# EasyEDA Pro project joint_controller.eprj

# Schematic Schematic1
Board Name: Board1; Create Date: 2025-11-14; Page Name: P1; Project Name: joint_controller; Schematic Name: Schematic1; Update Date: 2025-11-22; Company: 嘉立创EDA; Page Size: A4; Version: V1.0
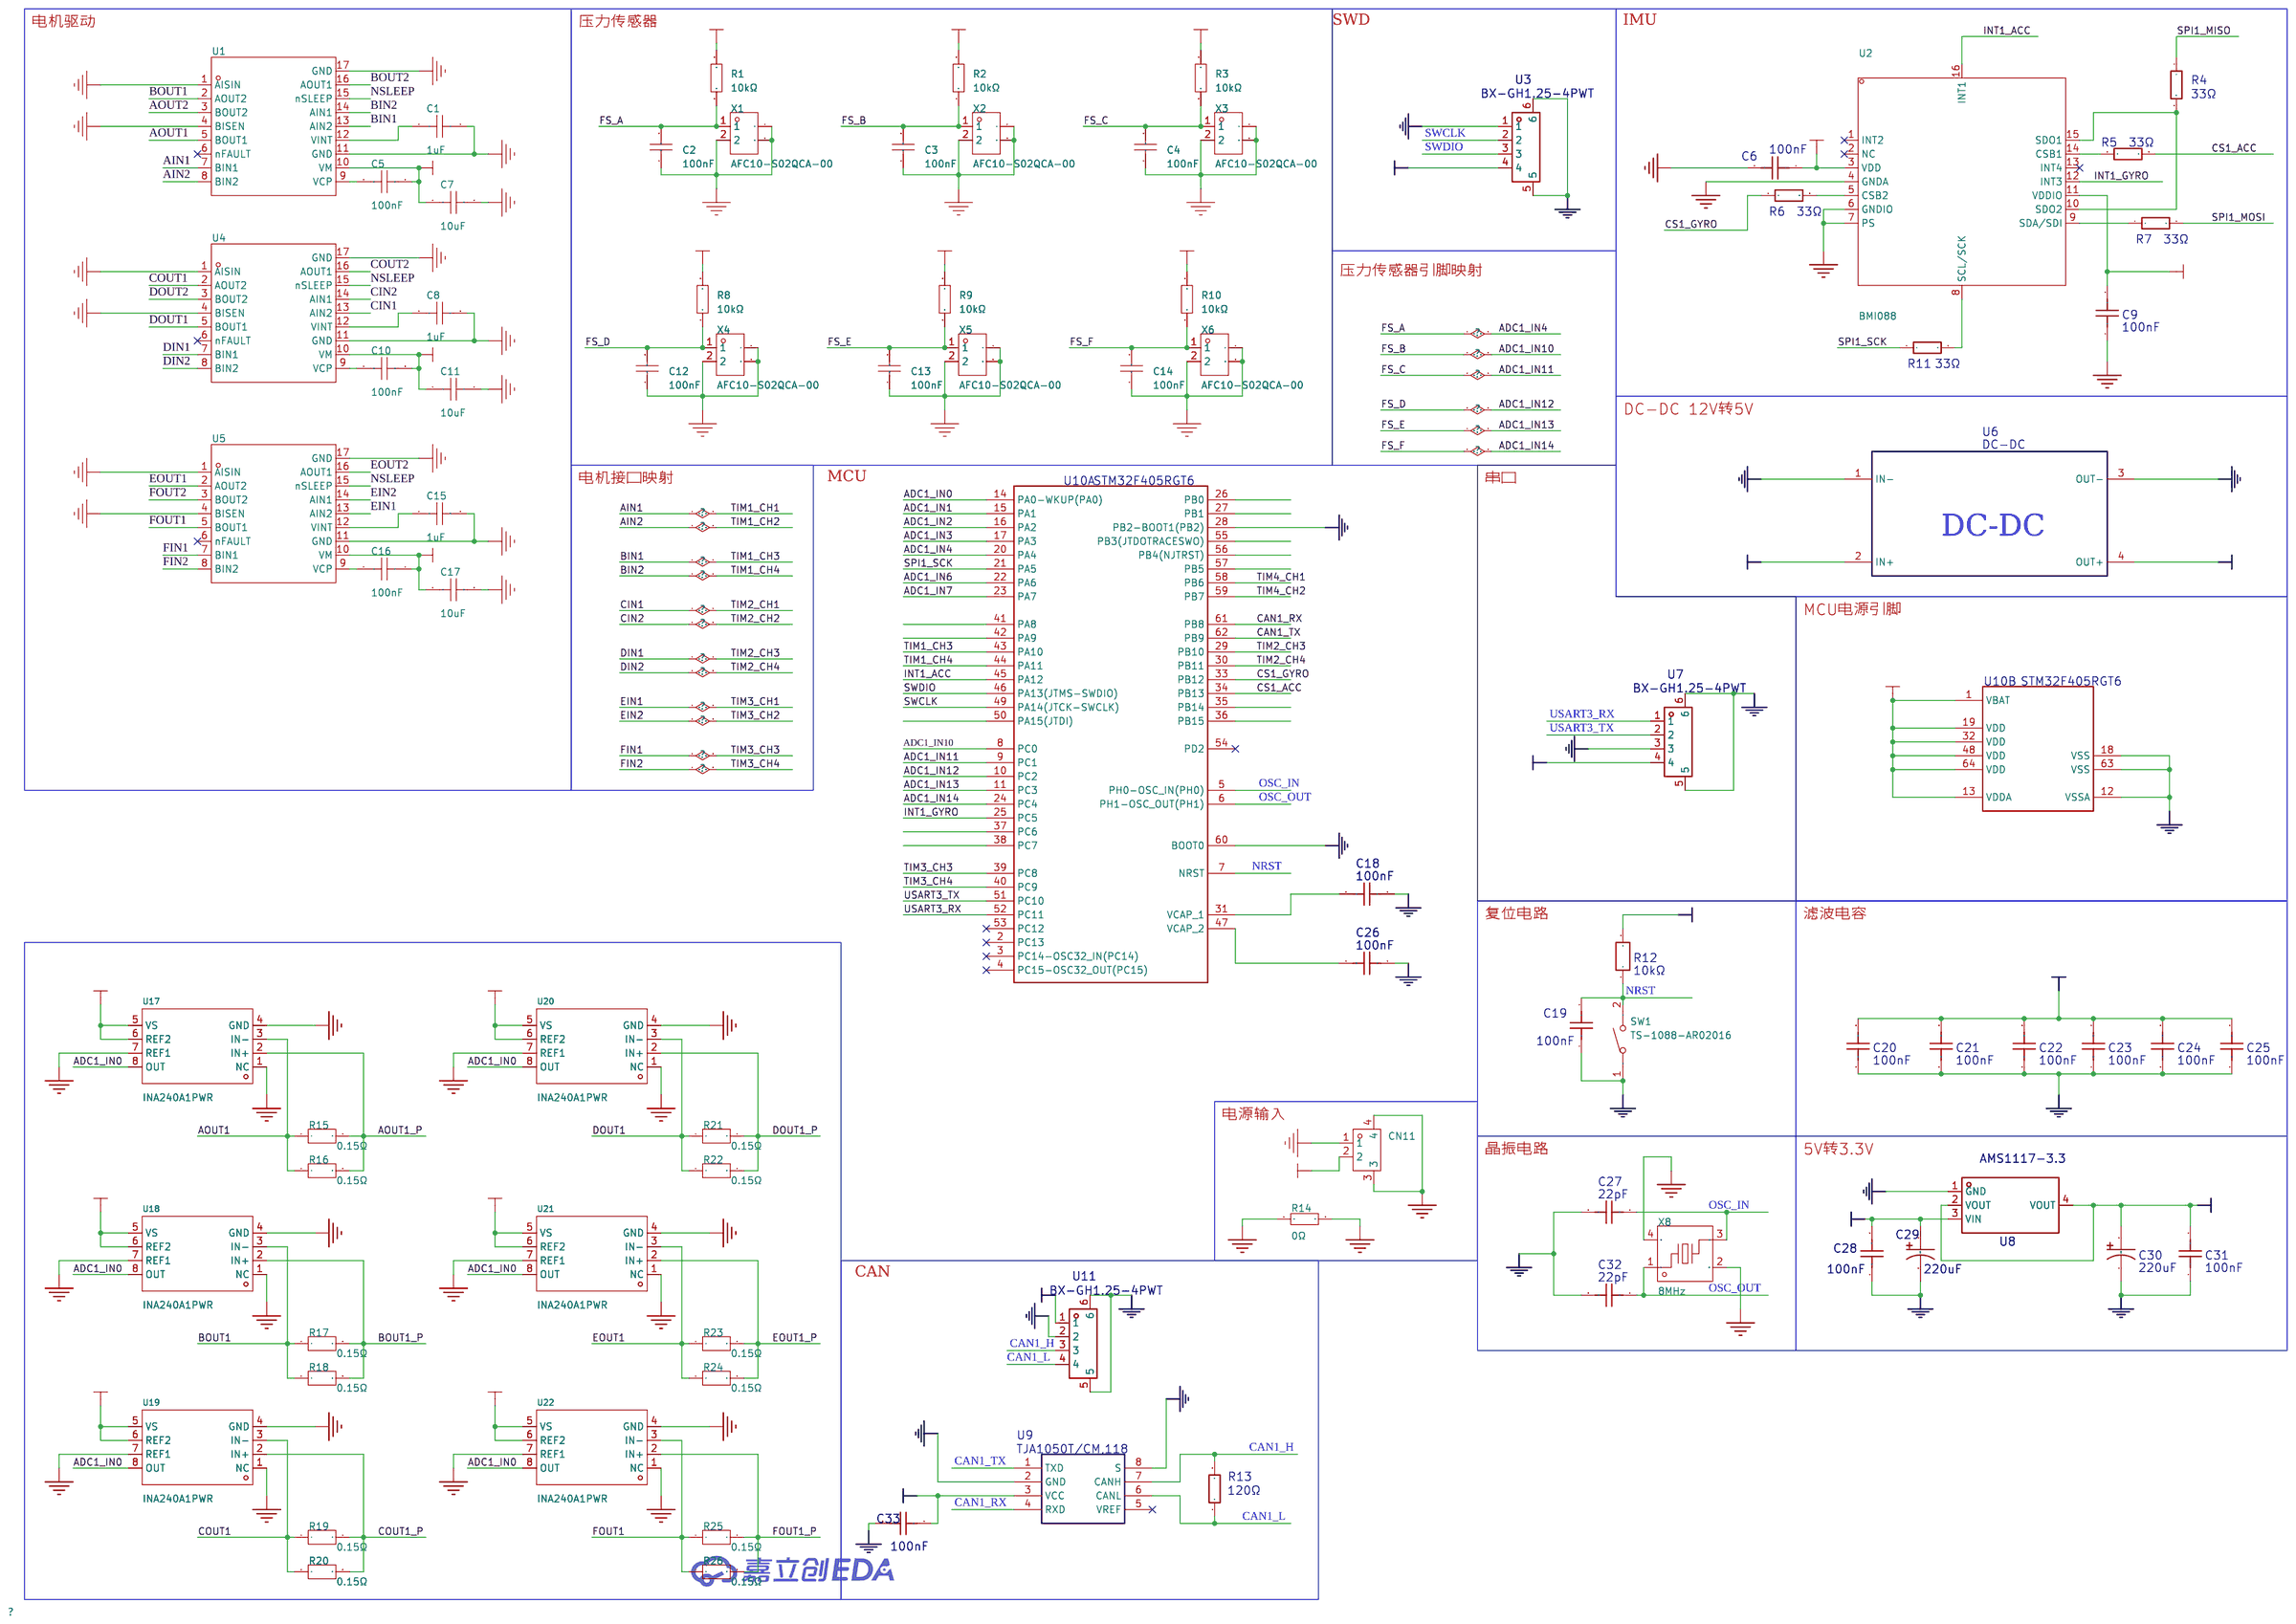
[diagram p0: schematic sheet]

## Parts
C1  1uF  [C0402]
C2  100nF  [C0402]
C3  100nF  [C0402]
C4  100nF  [C0402]
C5  100nF  [C0402]
C6  100nF  [C0603]
C7  10uF  [C0603]
C8  1uF  [C0402]
C9  100nF  [C0603]
C10  100nF  [C0402]
C11  10uF  [C0603]
C12  100nF  [C0402]
C13  100nF  [C0402]
C14  100nF  [C0402]
C15  1uF  [C0402]
C16  100nF  [C0402]
C17  10uF  [C0603]
C18  100nF  [C0603]
C19  100nF  [C0603]
C20  100nF  [C0603]
C21  100nF  [C0603]
C22  100nF  [C0603]
C23  100nF  [C0603]
C24  100nF  [C0603]
C25  100nF  [C0603]
C26  100nF  [C0603]
C27  22pF  [C0603]
C28  100nF  [C0603]
C29  220uF  [CAP-SMD_BD6.3-L6.6-W6.6-FD]
C30  220uF  [CAP-SMD_BD6.3-L6.6-W6.6-FD]
C31  100nF  [C0603]
C32  22pF  [C0603]
C33  100nF  [C0603]
CN11  M2501RS-02P  [CONN-SMD_2P-P2.50_M2501RS-02P]
R1  10kΩ  [R0402]
R2  10kΩ  [R0402]
R3  10kΩ  [R0402]
R4  33Ω  [R0805]
R5  33Ω  [R0805]
R6  33Ω  [R0805]
R7  33Ω  [R0805]
R8  10kΩ  [R0402]
R9  10kΩ  [R0402]
R10  10kΩ  [R0402]
R11  33Ω  [R0805]
R12  10kΩ  [R0603]
R13  120Ω  [R0805]
R14  0Ω  [R0603]
R15  0.15Ω  [R1812]
R16  0.15Ω  [R1812]
R17  0.15Ω  [R1812]
R18  0.15Ω  [R1812]
R19  0.15Ω  [R1812]
R20  0.15Ω  [R1812]
R21  0.15Ω  [R1812]
R22  0.15Ω  [R1812]
R23  0.15Ω  [R1812]
R24  0.15Ω  [R1812]
R25  0.15Ω  [R1812]
R26  0.15Ω  [R1812]
SW1  TS-1088-AR02016  [SW-SMD_L3.9-W3.0-P4.45]
U1  AT8833CQ  [QFN-16_L4.0-W4.0-P0.65-TL-EP2.2]
U2  BMI088  [LGA-16_L4.5-W3.0-P0.50-BL]
U3  BX-GH1.25-4PWT  [CONN-SMD_4P-P1.25_BX-GH1.25-4PWT]
U4  AT8833CQ  [QFN-16_L4.0-W4.0-P0.65-TL-EP2.2]
U5  AT8833CQ  [QFN-16_L4.0-W4.0-P0.65-TL-EP2.2]
U6  DC-DC  [DC-DC]
U7  BX-GH1.25-4PWT  [CONN-SMD_4P-P1.25_BX-GH1.25-4PWT]
U8  AMS1117-3.3  [SOT-223-3_L6.5-W3.4-P2.30-LS7.0-BR]
U9  TJA1050T/CM,118  [SOIC-8_L5.0-W4.0-P1.27-LS6.0-BL]
U10  STM32F405RGT6  [LQFP-64_L10.0-W10.0-P0.50-LS12.0-BL]  (sections 1,2)
U11  BX-GH1.25-4PWT  [CONN-SMD_4P-P1.25_BX-GH1.25-4PWT]
U17  INA240A1PWR  [TSSOP-8_L4.4-W3.0-P0.65-LS6.4-BL]
U18  INA240A1PWR  [TSSOP-8_L4.4-W3.0-P0.65-LS6.4-BL]
U19  INA240A1PWR  [TSSOP-8_L4.4-W3.0-P0.65-LS6.4-BL]
U20  INA240A1PWR  [TSSOP-8_L4.4-W3.0-P0.65-LS6.4-BL]
U21  INA240A1PWR  [TSSOP-8_L4.4-W3.0-P0.65-LS6.4-BL]
U22  INA240A1PWR  [TSSOP-8_L4.4-W3.0-P0.65-LS6.4-BL]
X1  AFC10-S02QCA-00  [CONN-SMD_AFC10-S02QCA-00]
X2  AFC10-S02QCA-00  [CONN-SMD_AFC10-S02QCA-00]
X3  AFC10-S02QCA-00  [CONN-SMD_AFC10-S02QCA-00]
X4  AFC10-S02QCA-00  [CONN-SMD_AFC10-S02QCA-00]
X5  AFC10-S02QCA-00  [CONN-SMD_AFC10-S02QCA-00]
X6  AFC10-S02QCA-00  [CONN-SMD_AFC10-S02QCA-00]
X8  8MHz  [CRYSTAL-SMD_4P-L3.2-W2.5-BL]

## Library data of the parts
C1 C8 C15 = CL05A105KA5NQNC: 容值:1uF;精度:±10%;额定电压:25V;材质(温度系数):X5R;; LCSC Part Name: 1uF ±10% 25V; Supplier Part: C52923; Manufacturer: SAMSUNG(三星); Supplier Footprint: 0402; JLCPCB Part Class: Basic Part; Datasheet: https://atta.szlcsc.com/upload/public/pdf/source/20160103/1457707735223.pdf; Supplier: LCSC; Tolerance: ±10%; Voltage Rated: 25V; Temperature Coefficient: X5R
C2-C4 C12-C14 = CL05B104KO5NNNC: 容值:100nF;精度:±10%;额定电压:16V;材质(温度系数):X7R;; LCSC Part Name: 100nF ±10% 16V; Supplier Part: C1525; Manufacturer: SAMSUNG(三星); Supplier Footprint: 0402; JLCPCB Part Class: Basic Part; Datasheet: https://atta.szlcsc.com/upload/public/pdf/source/20160103/1457707674891.pdf; Supplier: LCSC; Tolerance: ±10%; Voltage Rated: 16V; Temperature Coefficient: X7R
C5 C10 C16 = CL05B104KB54PNC: 容值:100nF;精度:±10%;额定电压:50V;材质(温度系数):X7R;; LCSC Part Name: 100nF ±10% 50V; Supplier Part: C307331; Manufacturer: SAMSUNG(三星); Supplier Footprint: 0402; JLCPCB Part Class: 基础库; Datasheet: https://atta.szlcsc.com/upload/public/pdf/source/20181009/C307331_222F7C870FD3EA5F46F538B483443886.pdf; Supplier: LCSC; Tolerance: ±10%; Voltage Rated: 50V; Temperature Coefficient: X7R
C6 C9 C18-C26 C28 C31 C33 = 100nF: Supplier: LCSC; Supplier Part: C2266794; Manufacturer: Knowles(楼氏); Manufacturer Part: 0603J0250104KXR; JLCPCB Part Class: Extended Part
C7 C11 C17 = CL10A106MA8NRNC: 容值:10uF;精度:±20%;额定电压:25V;材质(温度系数):X5R;; LCSC Part Name: 10uF ±20% 25V; Supplier Part: C96446; Manufacturer: SAMSUNG(三星); Supplier Footprint: 0603; JLCPCB Part Class: 基础库; Datasheet: https://atta.szlcsc.com/upload/public/pdf/source/20160218/1457707763339.pdf; Supplier: LCSC; Tolerance: ±20%; Voltage Rated: 25V; Temperature Coefficient: X5R
C27 C32 = 22pF: Supplier: LCSC; Supplier Part: C2266794; Manufacturer: Knowles(楼氏); Manufacturer Part: 0603J0250104KXR; JLCPCB Part Class: Extended Part
C29 C30 = 220uF: Supplier: LCSC; Supplier Part: C165593; Manufacturer: SAMYOUNG(韩国三莹); Manufacturer Part: MVK 16V220M 6.3*8 6.3TP; JLCPCB Part Class: Extended Part
CN11 = M2501RS-02P: 参考系列:-;间距:2.5mm;插针结构:1x2P;排数:1;每排PIN数:2;行距:-;公母:公型插针;安装方式:卧贴;额定电流:3A;工作温度范围:-25℃~+85℃;; LCSC Part Name: 针座 XH 间距2.5mm 2P 卧式贴片 XH; Supplier Part: C520120; Manufacturer: XFCN(兴飞); Supplier Footprint: SMD,P=2.5mm; JLCPCB Part Class: Extended Part; Datasheet: https://atta.szlcsc.com/upload/public/pdf/source/20200424/C520124_816A4C8EE39FBA6CEF0C35CBCC209D62.pdf; Supplier: LCSC; Pitch: 2.5mm; Pins Structure: 1x2P; Number of Rows: 1; Number of PINs Per Row: 2; Gender: 公型插针; Mounting Style: 卧贴; Current Rating (Max): 3A; Operating Temperature Range: -25℃~+85℃
R1-R3 R8-R10 = 0402WGF1002TCE: 电阻类型:厚膜电阻;阻值:10kΩ;精度:±1%;功率:62.5mW;温度系数:±100ppm/℃;最大工作电压:50V;工作温度范围:-55℃~+155℃;; LCSC Part Name: 10kΩ ±1% 62.5mW; Supplier Part: C25744; Manufacturer: UNI-ROYAL(厚声); Supplier Footprint: 0402; JLCPCB Part Class: Basic Part; Datasheet: https://atta.szlcsc.com/upload/public/pdf/source/20200306/C422600_1E6D84923E4A46A82E41ADD87F860B5C.pdf; Supplier: LCSC; Type: 厚膜电阻; Tolerance: ±1%; Power(Watts): 62.5mW; Temperature Coefficient: ±100ppm/℃; Overload Voltage (Max): 50V; Operating Temperature Range: -55℃~+155℃
R4-R7 R11 = 1kΩ: Supplier: LCSC; Manufacturer: YAGEO(国巨); Manufacturer Part: RC0805FR-07120RL; Supplier Part: C114245; JLCPCB Part Class: Extended Part
R12 = 10kΩ: Supplier: LCSC; Supplier Part: C20138101; Manufacturer: VISHAY(威世); Manufacturer Part: MCT0603MG1002BP500; JLCPCB Part Class: Extended Part
R13 = 120Ω: Supplier: LCSC; Manufacturer: YAGEO(国巨); Manufacturer Part: RC0805FR-07120RL; Supplier Part: C114245; JLCPCB Part Class: Extended Part
R14 = 0603WAF0000T5E: LCSC Part Name: 0Ω ±1% 100mW 厚膜电阻; Supplier Part: C21189; Manufacturer: UNI-ROYAL(厚声); Supplier Footprint: 0603; JLCPCB Part Class: 基础库; Datasheet: https://item.szlcsc.com/datasheet/0603WAF0000T5E/21903.html; Supplier: LCSC; Type: 厚膜电阻; Tolerance: ±1%; Power(Watts): 100mW; Voltage-Supply(Max): 75V; Operating Temperature: -55℃~+155℃
R15-R26 = FRC1812J101 TS: 电阻类型:厚膜电阻;阻值:100Ω;精度:±5%;功率:750mW;最大工作电压:200V;温度系数:±100ppm/℃;; LCSC Part Name: 100Ω ±5% 750mW 厚膜电阻; Supplier Part: C2933911; Manufacturer: FOJAN(富捷); Supplier Footprint: 1812; JLCPCB Part Class: 扩展库; Datasheet: https://atta.szlcsc.com/upload/public/pdf/source/20211221/925EC7D7225764EE0046F22065062C87.pdf; Supplier: LCSC; Type: 厚膜电阻; Tolerance: ±5%; Power(Watts): 750mW; Overload Voltage (Max): 200V; Temperature Coefficient: ±100ppm/℃; Operating Temperature Range: -55℃~+155℃
SW1 = TS-1088-AR02016: 电路结构:单刀单掷;按钮形状:圆形按钮;作用力:160gf;安装方式:立贴;开关长度:4mm;开关宽度:3mm;开关高度:2mm;带支架:不带;触点电流:50mA;额定电压(DC):12V;绝缘电阻:100MΩ;机械寿命:10万次;; LCSC Part Name: 4*3*2mm 立贴 轻触开关; Supplier Part: C720477; Manufacturer: XUNPU(讯普); Supplier Footprint: SMD; JLCPCB Part Class: 扩展库; Datasheet: https://atta.szlcsc.com/upload/public/pdf/source/20200810/C720475_60D09DD6C54279ADDB2DC25100F1CC11.pdf; Supplier: LCSC; Circuit: 单刀单掷; Actuator Style: 圆形按钮; Operating Force: 160gf; Mounting Style: 立贴; Switch Length: 4mm; Switch Width: 3mm; Switch Height: 2mm; Strike Gundam: 不带; Contact Current: 50mA; Voltage Rating (DC): 12V; Insulation Resistance: 100MΩ; Actuator/Cap Color: 黑色; Pin Style: SMD接片; Mechanical Life: 10万次; Operating Temperature: -30℃~+80℃
U1 U4 U5 = AT8833CQ: Supplier Part: C5120769; Manufacturer: 杭州中科微; Supplier Footprint: QFN-16(4x4); JLCPCB Part Class: Extended Part; Datasheet: https://atta.szlcsc.com/upload/public/pdf/source/20220727/6D4FE8A3A8BFFCE3E1C587FA66432509.pdf; Supplier: LCSC
U2 = BMI088: 传感器类型:加速度计陀螺仪;; Supplier Part: C194919; Manufacturer: Bosch(博世); Supplier Footprint: LGA-16(3x4.5); JLCPCB Part Class: 扩展库; Datasheet: https://atta.szlcsc.com/upload/public/pdf/source/20180628/C194919_66CCF125FF968C218A4D358C68AC68D6.pdf; Supplier: LCSC; Sensor Type: 加速度计陀螺仪; Operating Temperature: -40℃~+85℃
U3 U7 U11 = BX-GH1.25-4PWT: Supplier: LCSC; Supplier Part: C18077720; Manufacturer: Bossie(博锡); JLCPCB Part Class: Extended Part
U6 = DC-DC: Supplier Part: C2875440
U8 = AMS1117-3.3: Supplier: LCSC; Manufacturer: AMS; Supplier Part: C6186; JLCPCB Part Class: Basic Part
U9 = TJA1050T/CM,118: Supplier: LCSC; Manufacturer: NXP(恩智浦); Supplier Part: C6952; JLCPCB Part Class: Extended Part
U10 = STM32F405RGT6: tags: STM32; image: http://image.lceda.cn/szlcsc/C15742.jpg; Supplier Part: C15742; Supplier: LCSC; Manufacturer: ST(意法半导体); JLCPCB Part Class: Extended Part
U17-U22 = INA240A1PWR: 放大器数:单路;; Supplier Part: C93965; Manufacturer: TI(德州仪器); Supplier Footprint: TSSOP-8; JLCPCB Part Class: 扩展库; Datasheet: https://www.ti.com/cn/lit/gpn/ina240; Supplier: LCSC; Number of Channels: 单路; Supply Current: 1.8mA; Operating Temperature: -40℃~+125℃
X1-X6 = AFC10-S02QCA-00: 参考系列:SH;间距:1mm;插针结构:1x2P;排数:1;每排PIN数:2;行距:-;公母:公型插针;安装方式:卧贴;额定电流:500mA;工作温度范围:-25℃~+85℃;; LCSC Part Name: 系列:SH 间距:1mm 1x2P 卧贴; Supplier Part: C2764181; Manufacturer: JS(钜硕电子); Supplier Footprint: SMD,P=1mm; JLCPCB Part Class: 扩展库; Datasheet: https://atta.szlcsc.com/upload/public/pdf/source/20210330/C2764181_391AED87194E28CE940989A69A8EDCC4.pdf; Supplier: LCSC; Reference Series: SH; Pitch: 1mm; Pins Structure: 1x2P; Number of Rows: 1; Number of PINs Per Row: 2; Gender: 公型插针; Mounting Style: 卧贴; Current Rating (Max): 500mA; Operating Temperature Range: -25℃~+85℃
X8 = X32258MSB4SI: LCSC Part Name: YSX321SL 8MHZ 4P 3225 20PF ±10PPM -40~85℃ (±20PPM); Supplier Part: C2682774; Manufacturer: YXC(扬兴晶振); Supplier Footprint: SMD3225-4P; JLCPCB Part Class: 扩展库; Datasheet: https://item.szlcsc.com/datasheet/X32258MSB4SI/2777871.html; Supplier: LCSC; Type: 贴片晶振; Normal temperature Frequency Tolerance: ±10ppm; Load Capacitance: 20pF; Frequency Stability: ±20ppm; Equivalent Series Resistance(ESR): 120Ω; Operating Temperature: -40℃~+85℃

## Nets
GND: C2.1 C3.1 C4.1 C6.2 C9.1 C12.1 C13.1 C14.1 C18.1 C19.1 C20.1 C21.1 C22.1 C23.1 C24.1 C25.1 C26.1 C27.2 C28.1 C29.2 C30.2 C31.1 C32.2 C33.2 R14.2 SW1.1 U2.4(GNDA) U2.6(GNDIO) U2.7(PS) U3.1 U3.5 U3.6 U6.3(OUT-) U7.3 U7.5 U7.6 U8.1(GND) U9.2(GND) U9.8(S) U10.12(VSSA) U10.18(VSS) U10.28(PB2-BOOT1(PB2)) U10.60(BOOT0) U10.63(VSS) U11.2 U11.5 U11.6 U17.1(NC) U17.4(GND) U17.7(REF1) U18.1(NC) U18.4(GND) U18.7(REF1) U19.1(NC) U19.4(GND) U19.7(REF1) U20.1(NC) U20.4(GND) U20.7(REF1) U21.1(NC) U21.4(GND) U21.7(REF1) U22.1(NC) U22.4(GND) U22.7(REF1) X1.2 X1.3 X1.4 X2.2 X2.3 X2.4 X3.2 X3.3 X3.4 X4.2 X4.3 X4.4 X5.2 X5.3 X5.4 X6.2 X6.3 X6.4 X8.2(GND) X8.4(GND)
PGND: C1.2 C7.2 C8.2 C11.2 C15.2 C17.2 CN11.1 CN11.3 CN11.4 R14.1 U1.1(AISIN) U1.4(BISEN) U1.11(GND) U1.17(GND) U4.1(AISIN) U4.4(BISEN) U4.11(GND) U4.17(GND) U5.1(AISIN) U5.4(BISEN) U5.11(GND) U5.17(GND) U6.1(IN-)
VCC: C28.2 C29.1 C33.1 U6.4(OUT+) U7.4 U8.3(VIN) U9.3(VCC) U11.1
VCC3.3: C6.1 C9.2 C20.2 C21.2 C22.2 C23.2 C24.2 C25.2 C30.1 C31.2 R1.2 R2.2 R3.2 R8.2 R9.2 R10.2 R12.2 U2.3(VDD) U2.11(VDDIO) U3.4 U8.2(VOUT) U8.4(VOUT) U10.1(VBAT) U10.13(VDDA) U10.19(VDD) U10.32(VDD) U10.48(VDD) U10.64(VDD) U17.5(VS) U17.6(REF2) U18.5(VS) U18.6(REF2) U19.5(VS) U19.6(REF2) U20.5(VS) U20.6(REF2) U21.5(VS) U21.6(REF2) U22.5(VS) U22.6(REF2)
VCC12V: C5.2 C7.1 C10.2 C11.1 C16.2 C17.1 CN11.2 U1.10(VM) U4.10(VM) U5.10(VM) U6.2(IN+)
ADC1_IN0: U10.14(PA0-WKUP(PA0)) U17.8(OUT) U18.8(OUT) U19.8(OUT) U20.8(OUT) U21.8(OUT) U22.8(OUT)
ADC1_IN1: U10.15(PA1)
ADC1_IN2: U10.16(PA2)
ADC1_IN3: U10.17(PA3)
ADC1_IN4: C2.2 R1.1 U10.20(PA4) X1.1
ADC1_IN6: U10.22(PA6)
ADC1_IN7: U10.23(PA7)
ADC1_IN10: C3.2 R2.1 U10.8(PC0) X2.1
ADC1_IN11: C4.2 R3.1 U10.9(PC1) X3.1
ADC1_IN12: C12.2 R8.1 U10.10(PC2) X4.1
ADC1_IN13: C13.2 R9.1 U10.11(PC3) X5.1
ADC1_IN14: C14.2 R10.1 U10.24(PC4) X6.1
AIN1: U1.7(BIN1)
AIN2: U1.8(BIN2)
AOUT1: R15.1 R16.1 U1.5(BOUT1) U17.3(IN-)
AOUT1_P: R15.2 R16.2 U17.2(IN+)
AOUT2: U1.3(BOUT2)
BIN1: U1.13(AIN2) U10.43(PA10)
BIN2: U1.14(AIN1) U10.44(PA11)
BOUT1: R17.1 R18.1 U1.2(AOUT2) U18.3(IN-)
BOUT1_P: R17.2 R18.2 U18.2(IN+)
BOUT2: U1.16(AOUT1)
CAN1_H: R13.2 U9.7(CANH) U11.3
CAN1_L: R13.1 U9.6(CANL) U11.4
CAN1_RX: U9.4(RXD) U10.61(PB8)
CAN1_TX: U9.1(TXD) U10.62(PB9)
CIN1: U4.13(AIN2)
CIN2: U4.14(AIN1)
COUT1: R19.1 R20.1 U4.2(AOUT2) U19.3(IN-)
COUT1_P: R19.2 R20.2 U19.2(IN+)
COUT2: U4.16(AOUT1)
CS1_ACC: R5.2 U10.34(PB13)
CS1_GYRO: R6.1 U10.33(PB12)
DIN1: U4.7(BIN1) U10.29(PB10)
DIN2: U4.8(BIN2) U10.30(PB11)
DOUT1: R21.1 R22.1 U4.5(BOUT1) U20.3(IN-)
DOUT1_P: R21.2 R22.2 U20.2(IN+)
DOUT2: U4.3(BOUT2)
EIN1: U5.13(AIN2)
EIN2: U5.14(AIN1)
EOUT1: R23.1 R24.1 U5.2(AOUT2) U21.3(IN-)
EOUT1_P: R23.2 R24.2 U21.2(IN+)
EOUT2: U5.16(AOUT1)
FIN1: U5.7(BIN1) U10.39(PC8)
FIN2: U5.8(BIN2) U10.40(PC9)
FOUT1: R25.1 R26.1 U5.5(BOUT1) U22.3(IN-)
FOUT1_P: R25.2 R26.2 U22.2(IN+)
FOUT2: U5.3(BOUT2)
INT1_ACC: U2.16(INT1) U10.45(PA12)
INT1_GYRO: U2.12(INT3) U10.25(PC5)
NRST: C19.2 R12.1 SW1.2 U10.7(NRST)
NSLEEP: U1.15(nSLEEP) U4.15(nSLEEP) U5.15(nSLEEP)
OSC_IN: C27.1 U10.5(PH0-OSC_IN(PH0)) X8.3
OSC_OUT: C32.1 U10.6(PH1-OSC_OUT(PH1)) X8.1
SPI1_MISO: R4.1
SPI1_MOSI: R7.2
SPI1_SCK: R11.1 U10.21(PA5)
SWCLK: U3.2 U10.49(PA14(JTCK-SWCLK))
SWDIO: U3.3 U10.46(PA13(JTMS-SWDIO))
TIM4_CH1: U10.58(PB6)
TIM4_CH2: U10.59(PB7)
USART3_RX: U7.1 U10.52(PC11)
USART3_TX: U7.2 U10.51(PC10)
$1N1891: C18.2 U10.31(VCAP_1)
$1N1892: C26.2 U10.47(VCAP_2)
$1N2860: R11.2 U2.8(SCL/SCK)
$1N2861: R7.1 U2.9(SDA/SDI)
$1N2862: R4.2 U2.10(SDO2) U2.15(SDO1)
$1N2873: R5.1 U2.14(CSB1)
$1N2876: R6.2 U2.5(CSB2)
$1N7459: C5.1 U1.9(VCP)
$1N7460: C1.1 U1.12(VINT)
$1N7509: C10.1 U4.9(VCP)
$1N7512: C16.1 U5.9(VCP)
$1N7513: C8.1 U4.12(VINT)
$1N7515: C15.1 U5.12(VINT)

Not connected (* = marked no-connect by the designer): U1 6(nFAULT)*; U2 1(INT2)* 2(NC)* 13(INT4)*; U4 6(nFAULT)*; U5 6(nFAULT)*; U9 5(VREF)*; U10 2(PC13)* 3(PC14-OSC32_IN(PC14))* 4(PC15-OSC32_OUT(PC15))* 26(PB0) 27(PB1) 35(PB14) 36(PB15) 37(PC6) 38(PC7) 41(PA8) 42(PA9) 50(PA15(JTDI)) 53(PC12)* 54(PD2)* 55(PB3(JTDOTRACESWO)) 56(PB4(NJTRST)) 57(PB5)

## Notes on the sheet
- 电机驱动
- 压力传感器
- SWD
- IMU
- 压力传感器引脚映射
- DC-DC 12V转5V
- 电机接口映射
- MCU
- 串口
- MCU电源引脚
- 复位电路
- 滤波电容
- 电源输入
- 晶振电路
- 5V转3.3V
- CAN

# Board PCB1
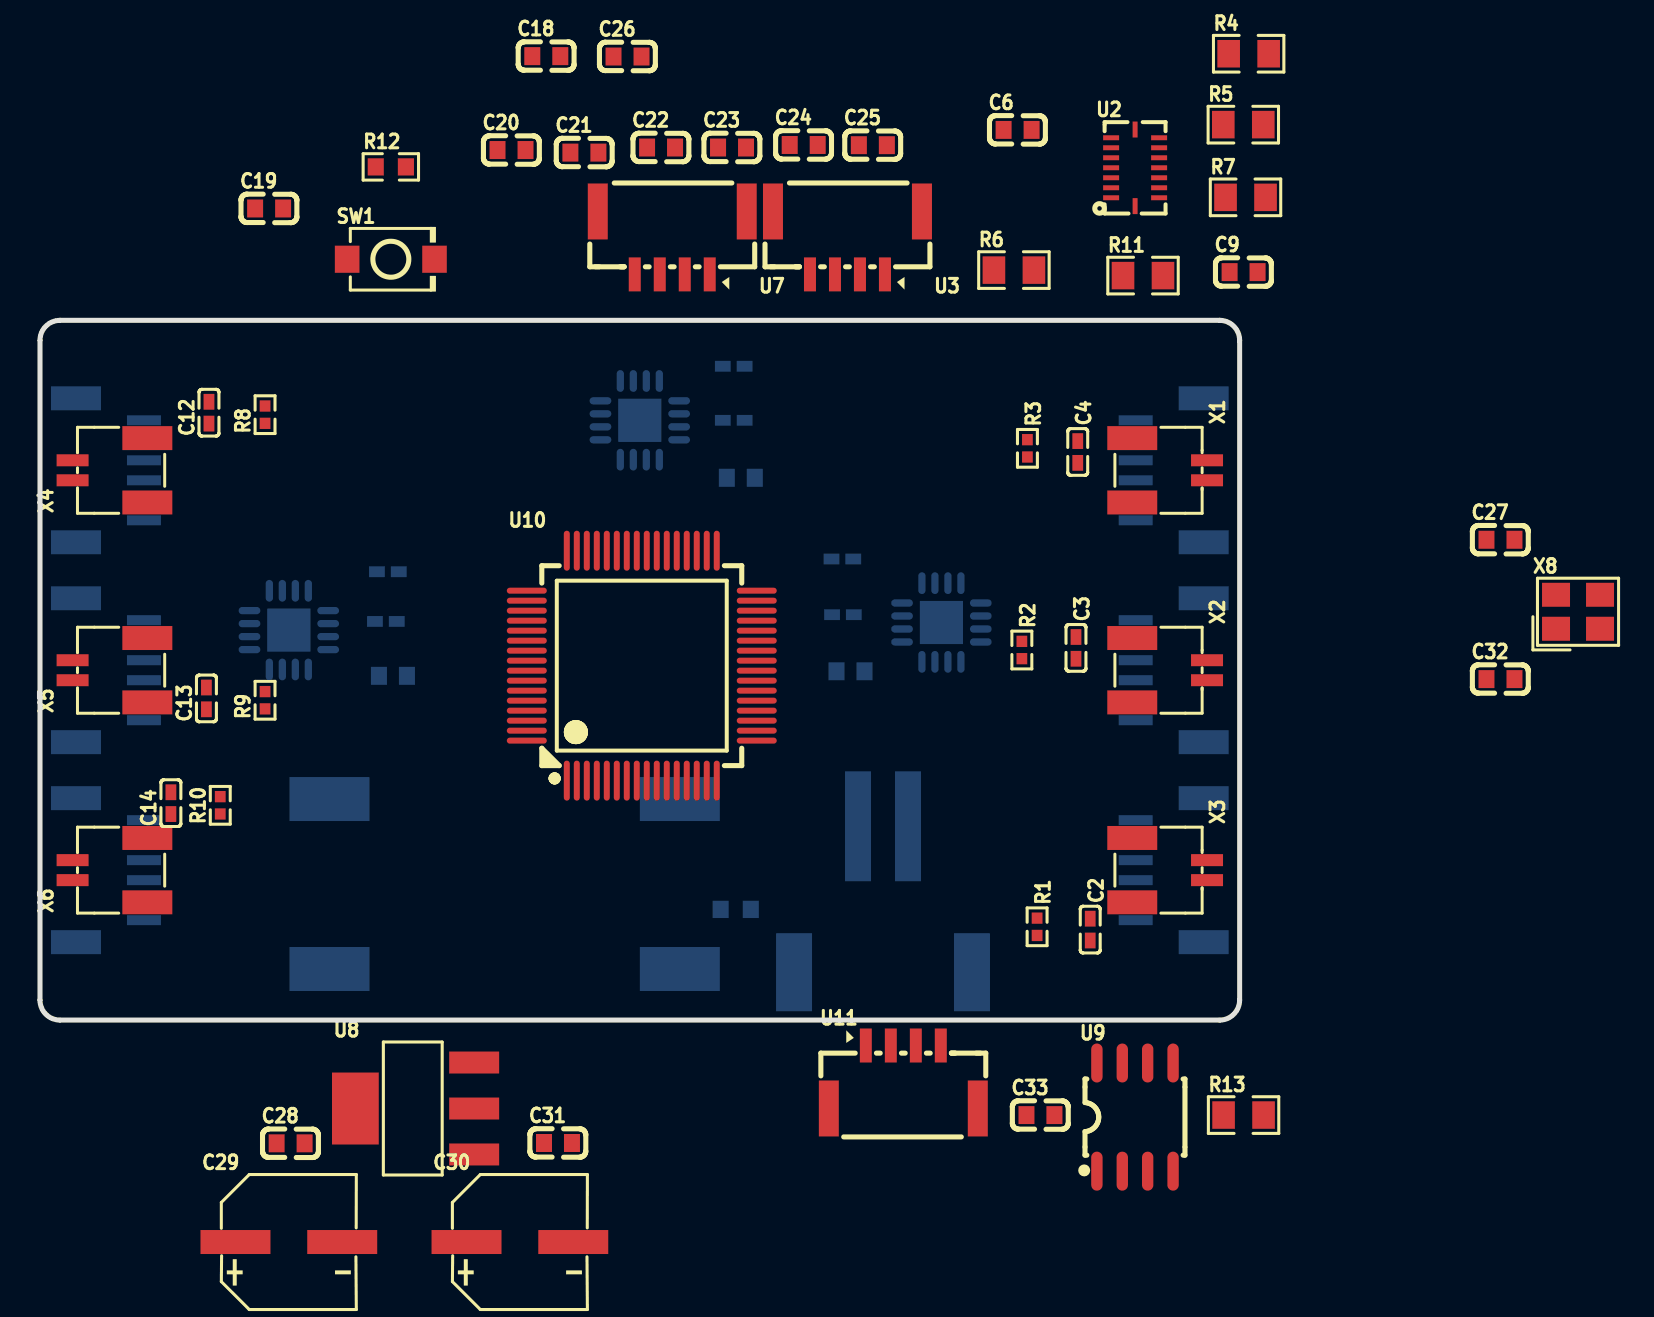
[diagram p1: board, top side]
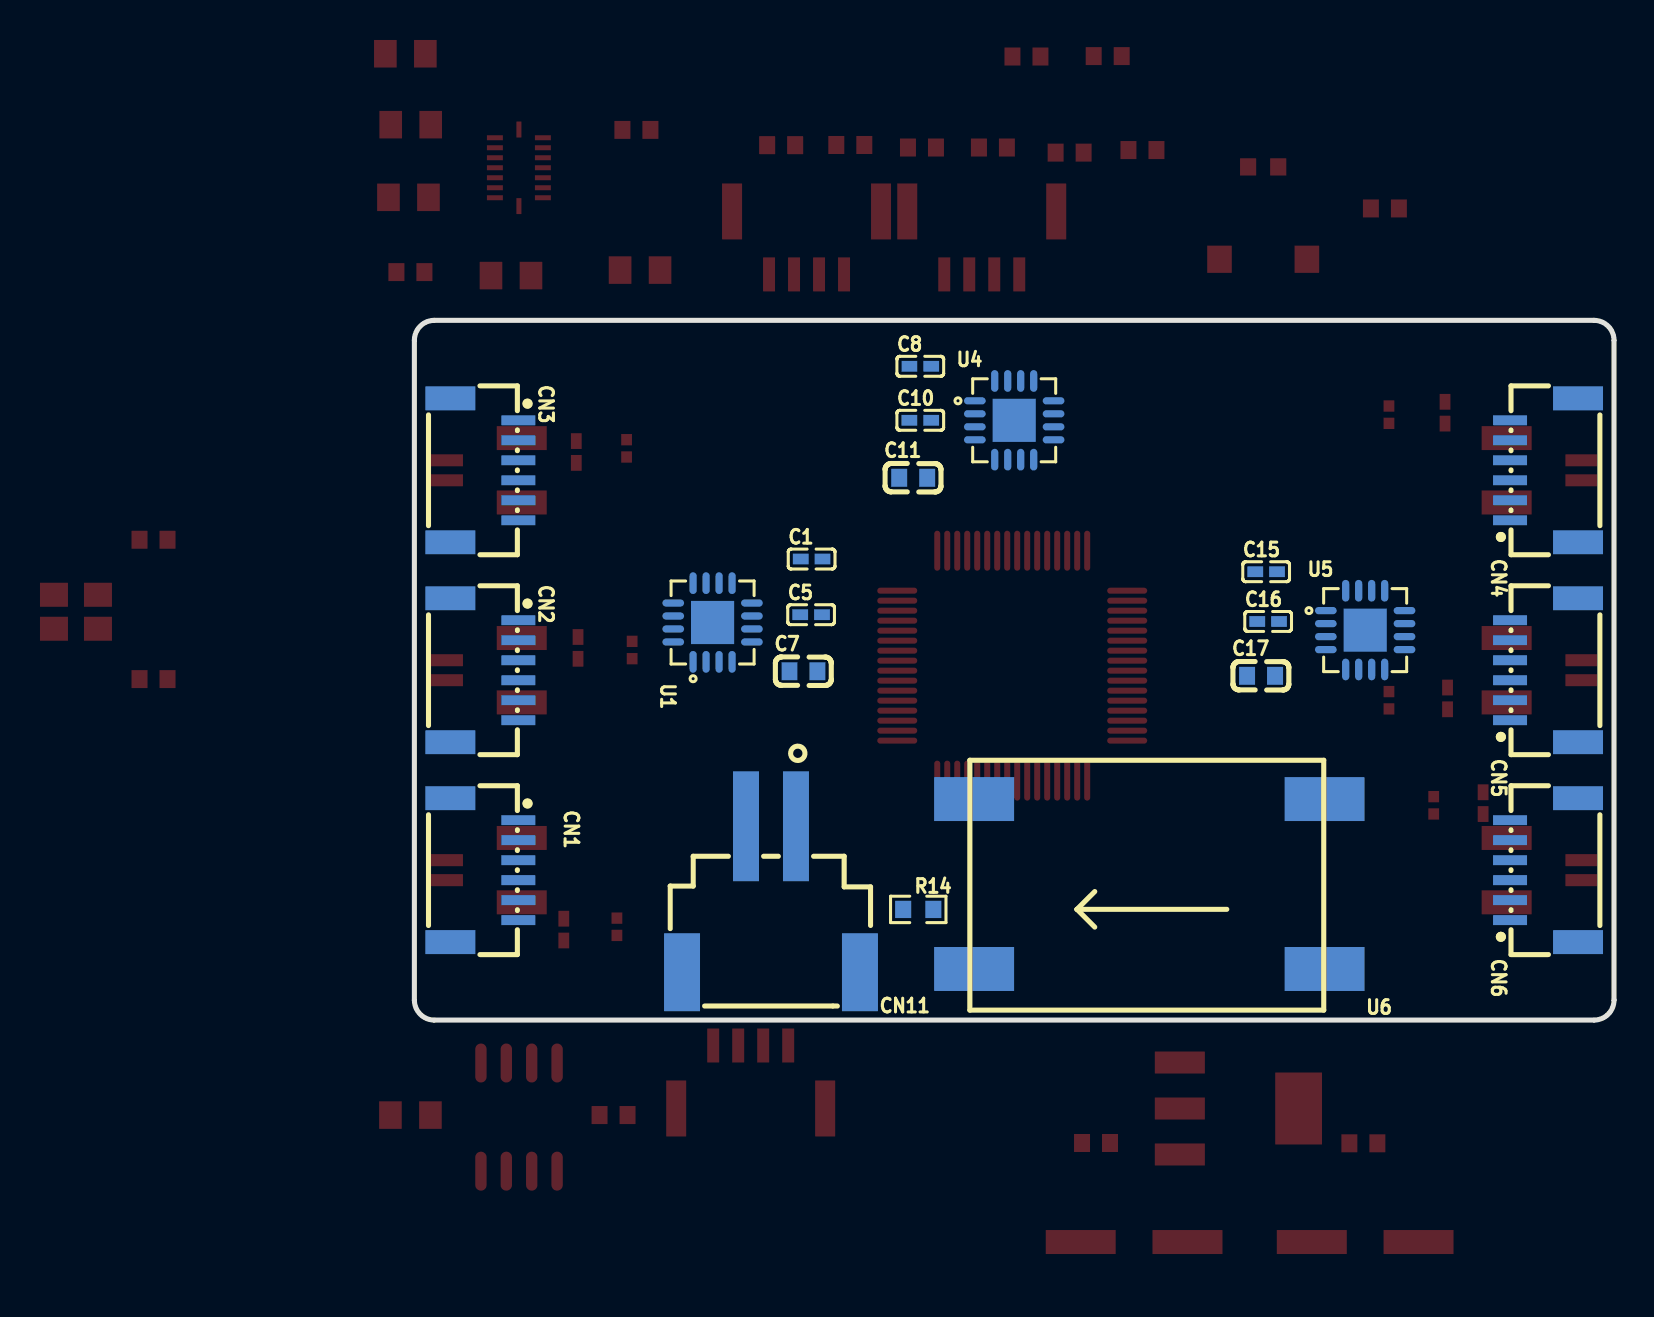
[diagram p2: board, bottom side, seen from below]

Outline 60 x 35 mm; copper layers: Top Layer, Bottom Layer. Coordinates in mm from the lower left corner of the outline.
Outline path: 0,34 0,1 arc(0.29,0.29) 1,0 59,0 arc(59.71,0.29) 60,1 60,34 arc(59.71,34.71) 59,35 1,35 arc(0.29,34.71) 0,34
Stack: Top Layer 0.035mm / Dielectric1 1.51mm FR4 er 4.5 / Bottom Layer 0.035mm

## Design rules (mm)
template: JLCPCB Capability(Two Layers Board)
spacing copperThickness1oz (default): track to track 0.102, other pairs 0.152 to 0.3
spacing copperThickness2oz: track to track 0.203, other pairs 0.152 to 0.3
track width copperThickness1oz (default): min 0.127, default 0.254, max 2.54
track width copperThickness2oz: min 0.203, default 0.254, max 2.54
differential pair differentialPair (default): width min 0.127, default 0.254, max 2.54; gap min 0.152, default 0.152
via viaSize (default): diameter min 0.5, default 0.61, max 10; hole min 0.3, default 0.305, max 6.3

## Placement (name value [footprint] x y rotation side)
C1  1uF  [C0402]  40.13 23.06 180 bottom
C2  100nF  [C0402]  52.53 4.53 270 top
C3  100nF  [C0402]  51.82 18.62 270 top
C4  100nF  [C0402]  51.9 28.42 270 top
C5  100nF  [C0402]  40.16 20.28 180 bottom
C6  100nF  [C0603]  48.9 44.53 0 top
C7  10uF  [C0603]  40.54 17.45 180 bottom
C8  1uF  [C0402]  34.7 32.7 180 bottom
C9  100nF  [C0603]  60.2 37.41 0 top
C10  100nF  [C0402]  34.7 30 180 bottom
C11  10uF  [C0603]  35.05 27.13 180 bottom
C12  100nF  [C0402]  8.45 30.38 90 top
C13  100nF  [C0402]  8.32 16.09 90 top
C14  100nF  [C0402]  6.55 10.85 90 top
C15  1uF  [C0402]  17.4 22.43 180 bottom
C16  100nF  [C0402]  17.3 19.94 180 bottom
C17  10uF  [C0603]  17.65 17.22 180 bottom
C18  100nF  [C0603]  25.32 48.22 0 top
C19  100nF  [C0603]  11.46 40.6 0 top
C20  100nF  [C0603]  23.59 43.52 0 top
C21  100nF  [C0603]  27.23 43.39 0 top
C22  100nF  [C0603]  31.06 43.64 0 top
C23  100nF  [C0603]  34.61 43.64 0 top
C24  100nF  [C0603]  38.2 43.77 0 top
C25  100nF  [C0603]  41.66 43.76 0 top
C26  100nF  [C0603]  29.39 48.2 0 top
C27  22pF  [C0603]  73.05 24.03 0 top
C28  100nF  [C0603]  12.54 -6.16 0 top
C29  220uF  [CAP-SMD_BD6.3-L6.6-W6.6-FD]  12.45 -11.1 0 top
C30  220uF  [CAP-SMD_BD6.3-L6.6-W6.6-FD]  24 -11.1 0 top
C31  100nF  [C0603]  25.91 -6.15 0 top
C32  22pF  [C0603]  73.05 17.06 0 top
C33  100nF  [C0603]  50.04 -4.75 0 top
CN1  WAFER-SH1.0-6PWB  [CONN-SMD_6P-P1.00_XUNPU_WAFER-SH1.0-6PWB]  56.5 7.5 270 bottom
CN2  WAFER-SH1.0-6PWB  [CONN-SMD_6P-P1.00_XUNPU_WAFER-SH1.0-6PWB]  56.5 17.5 270 bottom
CN3  WAFER-SH1.0-6PWB  [CONN-SMD_6P-P1.00_XUNPU_WAFER-SH1.0-6PWB]  56.5 27.5 270 bottom
CN4  WAFER-SH1.0-6PWB  [CONN-SMD_6P-P1.00_XUNPU_WAFER-SH1.0-6PWB]  3.5 27.5 90 bottom
CN5  WAFER-SH1.0-6PWB  [CONN-SMD_6P-P1.00_XUNPU_WAFER-SH1.0-6PWB]  3.5 17.5 90 bottom
CN6  WAFER-SH1.0-6PWB  [CONN-SMD_6P-P1.00_XUNPU_WAFER-SH1.0-6PWB]  3.5 7.5 90 bottom
CN11  M2501RS-02P  [CONN-SMD_2P-P2.50_M2501RS-02P]  42.16 6.04 0 bottom
R1  10kΩ  [R0402]  49.87 4.67 270 top
R2  10kΩ  [R0402]  49.11 18.51 270 top
R3  10kΩ  [R0402]  49.39 28.6 270 top
R4  33Ω  [R0805]  60.45 48.33 0 top
R5  33Ω  [R0805]  60.18 44.79 0 top
R6  33Ω  [R0805]  48.71 37.51 0 top
R7  33Ω  [R0805]  60.3 41.15 0 top
R8  10kΩ  [R0402]  11.26 30.28 90 top
R9  10kΩ  [R0402]  11.26 16 90 top
R10  10kΩ  [R0402]  9.02 10.74 90 top
R11  33Ω  [R0805]  55.17 37.24 0 top
R12  10kΩ  [R0603]  17.55 42.68 0 top
R13  120Ω  [R0805]  60.2 -4.75 0 top
R14  0Ω  [R0603]  34.8 5.54 0 bottom
SW1  TS-1088-AR02016  [SW-SMD_L3.9-W3.0-P4.45]  17.55 38.06 0 top
U1  AT8833CQ  [QFN-16_L4.0-W4.0-P0.65-TL-EP2.2]  45.09 19.89 90 bottom
U2  BMI088  [LGA-16_L4.5-W3.0-P0.50-BL]  54.77 42.63 0 top
U3  BX-GH1.25-4PWT  [CONN-SMD_4P-P1.25_BX-GH1.25-4PWT]  40.39 38.87 180 top
U4  AT8833CQ  [QFN-16_L4.0-W4.0-P0.65-TL-EP2.2]  30 30 180 bottom
U5  AT8833CQ  [QFN-16_L4.0-W4.0-P0.65-TL-EP2.2]  12.45 19.51 180 bottom
U6  -  [DC-DC]  23.24 6.81 0 bottom
U7  BX-GH1.25-4PWT  [CONN-SMD_4P-P1.25_BX-GH1.25-4PWT]  31.62 38.87 180 top
U8  AMS1117-3.3  [SOT-223-3_L6.5-W3.4-P2.30-LS7.0-BR]  18.75 -4.42 0 top
U9  TJA1050T/CM,118  [SOIC-8_L5.0-W4.0-P1.27-LS6.0-BL]  54.77 -4.85 0 top
U10  STM32F405RGT6  [LQFP-64_L10.0-W10.0-P0.50-LS12.0-BL]  30.1 17.73 0 top
U11  BX-GH1.25-4PWT  [CONN-SMD_4P-P1.25_BX-GH1.25-4PWT]  43.18 -2.85 0 top
X1  AFC10-S02QCA-00  [CONN-SMD_AFC10-S02QCA-00]  56.5 27.5 270 top
X2  AFC10-S02QCA-00  [CONN-SMD_AFC10-S02QCA-00]  56.5 17.5 270 top
X3  AFC10-S02QCA-00  [CONN-SMD_AFC10-S02QCA-00]  56.5 7.5 270 top
X4  AFC10-S02QCA-00  [CONN-SMD_AFC10-S02QCA-00]  3.5 27.5 90 top
X5  AFC10-S02QCA-00  [CONN-SMD_AFC10-S02QCA-00]  3.5 17.5 90 top
X6  AFC10-S02QCA-00  [CONN-SMD_AFC10-S02QCA-00]  3.5 7.5 90 top
X8  8MHz  [CRYSTAL-SMD_4P-L3.2-W2.5-BL]  76.93 20.42 0 top

## Footprints (pads in the part's own frame, mm; a bottom-side part is the same pattern mirrored in y, then rotated)
C0402
  rect 0.79x0.54 smd: 1(-0.545,0) 2(0.545,0)
C0603
  rect 0.8x0.9 smd: 1(-0.7,0) 2(0.7,0)
CAP-SMD_BD6.3-L6.6-W6.6-FD
  rect 3.5x1.2 smd: 1(-2.67,0) 2(2.67,0)
CONN-SMD_2P-P2.50_M2501RS-02P
  rect 1.3x5.5 smd: 1(-1.25,-3.65) 2(1.25,-3.65)
  rect 1.8x3.9 smd: 3(4.45,3.65) 4(-4.45,3.65)
CONN-SMD_4P-P1.25_BX-GH1.25-4PWT
  rect 0.6x1.7 smd: 1(-1.875,1.575) 2(-0.625,1.575) 3(0.625,1.575) 4(1.875,1.575)
  rect 1x2.8 smd: 5(3.725,-1.575) 6(-3.725,-1.575)
CONN-SMD_6P-P1.00_XUNPU_WAFER-SH1.0-6PWB
  rect 0.5x1.7 smd: 1(-2.5,1.7) 2(-1.5,1.7) 3(-0.5,1.7) 4(0.5,1.7) 5(1.5,1.7) 6(2.5,1.7)
  rect 1.2x2.5 smd: 7(3.6,-1.7) 8(-3.6,-1.7)
CONN-SMD_AFC10-S02QCA-00
  rect 0.6x1.6 smd: 1(-0.5,1.87) 2(0.5,1.87)
  rect 1.2x2.5 smd: 3(-1.61,-1.87) 4(1.61,-1.87)
CRYSTAL-SMD_4P-L3.2-W2.5-BL
  rect 1.4x1.2 smd: 1(-1.1,-0.85) 2(1.1,-0.85) 3(1.1,0.85) 4(-1.1,0.85)
DC-DC
  rect 4x2.2 smd: 1(-8.763,4.25) 2(-8.763,-4.25) 3(8.763,4.25) 4(8.763,-4.25)
LGA-16_L4.5-W3.0-P0.50-BL
  rect 0.8x0.25 smd: 1(-1.2,-1.498) 2(-1.2,-0.998) 3(-1.2,-0.498) 4(-1.2,0.002) 5(-1.2,0.502) 6(-1.2,1.002) 7(-1.2,1.502) 9(1.2,1.502) 10(1.2,1.002) 11(1.2,0.502) 12(1.2,0.002) 13(1.2,-0.498) 14(1.2,-0.998) 15(1.2,-1.498)
  rect 0.25x0.8 smd: 8(0,1.915) 16(0,-1.915)
LQFP-64_L10.0-W10.0-P0.50-LS12.0-BL
  oval 0.3x2 smd: 1(-3.75,-5.75) 2(-3.25,-5.75) 3(-2.75,-5.75) 4(-2.25,-5.75) 5(-1.75,-5.75) 6(-1.25,-5.75) 7(-0.75,-5.75) 8(-0.25,-5.75) 9(0.25,-5.75) 10(0.75,-5.75) 11(1.25,-5.75) 12(1.75,-5.75) 13(2.25,-5.75) 14(2.75,-5.75) 15(3.25,-5.75) 16(3.75,-5.75) 33(3.75,5.75) 34(3.25,5.75) 35(2.75,5.75) 36(2.25,5.75) 37(1.75,5.75) 38(1.25,5.75) 39(0.75,5.75) 40(0.25,5.75) 41(-0.25,5.75) 42(-0.75,5.75) 43(-1.25,5.75) 44(-1.75,5.75) 45(-2.25,5.75) 46(-2.75,5.75) 47(-3.25,5.75) 48(-3.75,5.75)
  oval 2x0.3 smd: 17(5.75,-3.75) 18(5.75,-3.25) 19(5.75,-2.75) 20(5.75,-2.25) 21(5.75,-1.75) 22(5.75,-1.25) 23(5.75,-0.75) 24(5.75,-0.25) 25(5.75,0.25) 26(5.75,0.75) 27(5.75,1.25) 28(5.75,1.75) 29(5.75,2.25) 30(5.75,2.75) 31(5.75,3.25) 32(5.75,3.75) 49(-5.75,3.75) 50(-5.75,3.25) 51(-5.75,2.75) 52(-5.75,2.25) 53(-5.75,1.75) 54(-5.75,1.25) 55(-5.75,0.75) 56(-5.75,0.25) 57(-5.75,-0.25) 58(-5.75,-0.75) 59(-5.75,-1.25) 60(-5.75,-1.75) 61(-5.75,-2.25) 62(-5.75,-2.75) 63(-5.75,-3.25) 64(-5.75,-3.75)
QFN-16_L4.0-W4.0-P0.65-TL-EP2.2
  oval 1.087x0.364 smd: 1(-1.968,0.975) 2(-1.968,0.325) 3(-1.968,-0.325) 4(-1.968,-0.975) 9(1.968,-0.975) 10(1.968,-0.325) 11(1.968,0.325) 12(1.968,0.975)
  oval 0.364x1.087 smd: 5(-0.975,-1.968) 6(-0.325,-1.968) 7(0.325,-1.968) 8(0.975,-1.968) 13(0.975,1.968) 14(0.325,1.968) 15(-0.325,1.968) 16(-0.975,1.968)
  rect 2.16x2.16 smd: 17(0,0)
R0402
  rect 0.566x0.54 smd: 1(-0.433,0) 2(0.433,0)
R0603
  rect 0.806x0.864 smd: 1(-0.753,0) 2(0.753,0)
R0805
  rect 1.133x1.377 smd: 1(-1,0) 2(1,0)
SOIC-8_L5.0-W4.0-P1.27-LS6.0-BL
  oval 0.569x1.95 smd: 1(-1.905,-2.705) 2(-0.635,-2.705) 3(0.635,-2.705) 4(1.905,-2.705) 5(1.905,2.705) 6(0.635,2.705) 7(-0.635,2.705) 8(-1.905,2.705)
SOT-223-3_L6.5-W3.4-P2.30-LS7.0-BR
  rect 2.5x1.1 smd: 1(2.97,-2.3) 2(2.97,0) 3(2.97,2.3)
  rect 2.34x3.6 smd: 4(-2.97,0)
SW-SMD_L3.9-W3.0-P4.45
  rect 1.23x1.36 smd: 1(-2.185,0) 2(2.185,0)

## Nets
GND: C2.1 C3.1 C4.1 C6.2 C9.1 C12.1 C13.1 C14.1 C18.1 C19.1 C20.1 C21.1 C22.1 C23.1 C24.1 C25.1 C26.1 C27.2 C28.1 C29.2 C30.2 C31.1 C32.2 C33.2 CN1.5 CN2.5 CN3.5 CN4.5 CN5.5 CN6.5 R14.2 SW1.1 U2.4 U2.6 U2.7 U3.1 U3.5 U3.6 U6.3 U7.3 U7.5 U7.6 U8.1 U9.2 U9.8 U10.12 U10.18 U10.28 U10.60 U10.63 U11.2 U11.5 U11.6 X1.2 X1.3 X1.4 X2.2 X2.3 X2.4 X3.2 X3.3 X3.4 X4.2 X4.3 X4.4 X5.2 X5.3 X5.4 X6.2 X6.3 X6.4 X8.2 X8.4
PGND: C1.2 C7.2 C8.2 C11.2 C15.2 C17.2 CN1.7 CN1.8 CN2.7 CN2.8 CN3.7 CN3.8 CN4.7 CN4.8 CN5.7 CN5.8 CN6.7 CN6.8 CN11.1 CN11.3 CN11.4 R14.1 U1.1 U1.4 U1.11 U1.17 U4.1 U4.4 U4.11 U4.17 U5.1 U5.4 U5.11 U5.17 U6.1
VCC: C28.2 C29.1 C33.1 U6.4 U7.4 U8.3 U9.3 U11.1
VCC3.3: C6.1 C9.2 C20.2 C21.2 C22.2 C23.2 C24.2 C25.2 C30.1 C31.2 CN1.2 CN2.2 CN3.2 CN4.2 CN5.2 CN6.2 R1.2 R2.2 R3.2 R8.2 R9.2 R10.2 R12.2 U2.3 U2.11 U3.4 U8.2 U8.4 U10.1 U10.13 U10.19 U10.32 U10.48 U10.64
VCC12V: C5.2 C7.1 C10.2 C11.1 C16.2 C17.1 CN11.2 U1.10 U4.10 U5.10 U6.2
ADC1_IN4: C2.2 R1.1 U10.20 X1.1
ADC1_IN10: C3.2 R2.1 U10.8 X2.1
ADC1_IN11: C4.2 R3.1 U10.9 X3.1
ADC1_IN12: C12.2 R8.1 U10.10 X4.1
ADC1_IN13: C13.2 R9.1 U10.11 X5.1
ADC1_IN14: C14.2 R10.1 U10.24 X6.1
AIN1: U1.7 U10.43
AIN2: U1.8 U10.44
AOUT1: CN1.1 U1.5
AOUT2: CN1.6 U1.3
AWE1: CN1.3 U10.41
AWE2: CN1.4 U10.42
BIN1: U1.13 U10.29
BIN2: U1.14 U10.30
BOUT1: CN2.1 U1.2
BOUT2: CN2.6 U1.16
BWE1: CN2.3 U10.50
BWE2: CN2.4 U10.55
CAN1_H: R13.2 U9.7 U11.3
CAN1_L: R13.1 U9.6 U11.4
CAN1_RX: U9.4 U10.61
CAN1_TX: U9.1 U10.62
CIN1: U4.13 U10.26 U10.39
CIN2: U4.14 U10.27 U10.40
COUT1: CN3.1 U4.2
COUT2: CN3.6 U4.16
CS1_ACC: R5.2 U10.34
CS1_GYRO: R6.1 U10.33
CWE1: CN3.3 U10.56
CWE2: CN3.4 U10.57
DIN1: U4.7 U10.35
DIN2: U4.8 U10.36
DOUT1: CN4.1 U4.5
DOUT2: CN4.6 U4.3
DWE1: CN4.3 U10.58
DWE2: CN4.4 U10.59
EIN1: U5.13 U10.16
EIN2: U5.14 U10.17
EOUT1: CN5.1 U5.2
EOUT2: CN5.6 U5.16
EWE1: CN5.3 U10.14
EWE2: CN5.4 U10.15
FIN1: U5.7
FIN2: U5.8
FOUT1: CN6.1 U5.5
FOUT2: CN6.6 U5.3
FWE1: CN6.3 U10.37
FWE2: CN6.4 U10.38
INT1_ACC: U2.16 U10.45
INT1_GYRO: U2.12 U10.25
NRST: C19.2 R12.1 SW1.2 U10.7
NSLEEP: U1.15 U4.15 U5.15
OSC_IN: C27.1 U10.5 X8.3
OSC_OUT: C32.1 U10.6 X8.1
SPI1_MISO: R4.1 U10.22
SPI1_MOSI: R7.2 U10.23
SPI1_SCK: R11.1 U10.21
SWCLK: U3.2 U10.49
SWDIO: U3.3 U10.46
USART3_RX: U7.1 U10.52
USART3_TX: U7.2 U10.51
$1N1891: C18.2 U10.31
$1N1892: C26.2 U10.47
$1N2860: R11.2 U2.8
$1N2861: R7.1 U2.9
$1N2862: R4.2 U2.10 U2.15
$1N2873: R5.1 U2.14
$1N2876: R6.2 U2.5
$1N7459: C5.1 U1.9
$1N7460: C1.1 U1.12
$1N7509: C10.1 U4.9
$1N7512: C16.1 U5.9
$1N7513: C8.1 U4.12
$1N7515: C15.1 U5.12

Pads without a net: U1 6; U2 1 2 13; U4 6; U5 6; U9 5; U10 2 3 4 53 54
